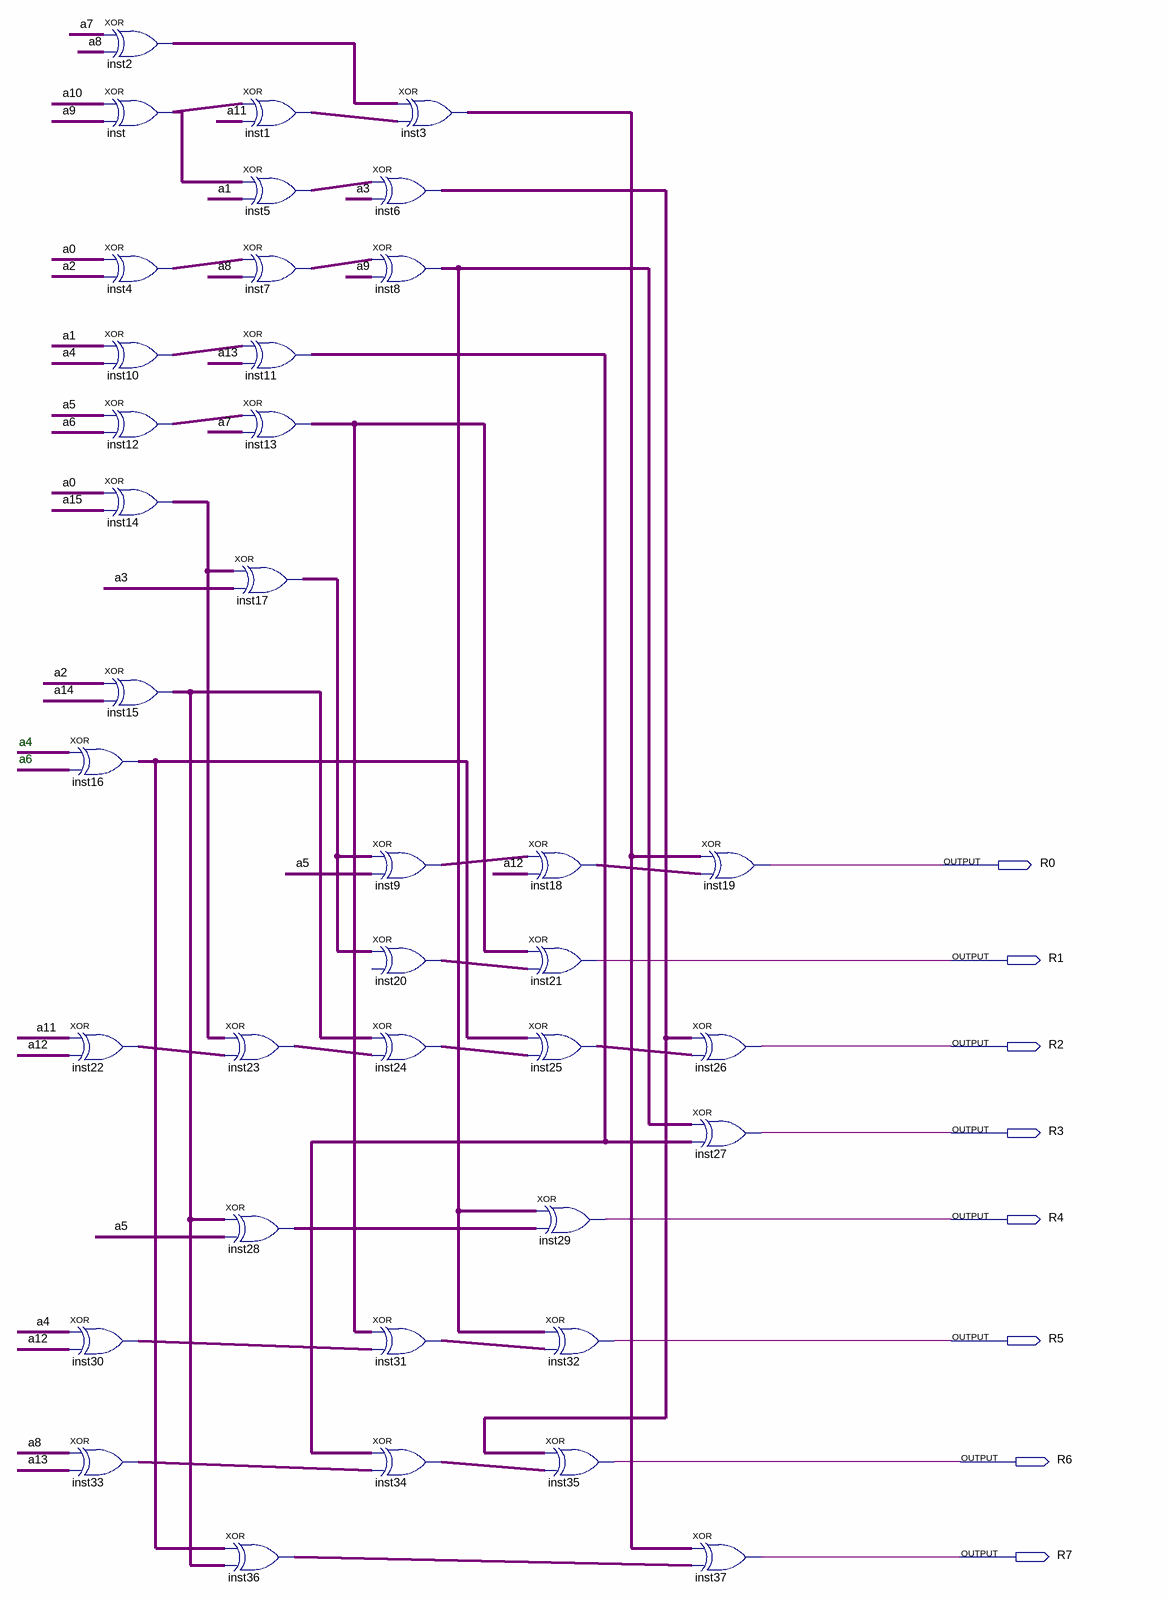
[diagram p0: schematic sheet]
// Quartus schematic encoderV4_Desenho.bdf as structural Verilog: 38 symbols, 8 pins
module encoderV4_Desenho (
  output R0,
  output R1,
  output R2,
  output R3,
  output R4,
  output R5,
  output R6,
  output R7
);

  wire a0, a1, a2, a3, a4, a5, a6, a7, a8, a9, a10, a11, a12, a13, a14, a15, inst1_out, inst2_out, inst3_out,
       inst4_out, inst5_out, inst6_out, inst7_out, inst8_out, inst9_out, inst10_out, inst11_out, inst12_out,
       inst13_out, inst14_out, inst15_out, inst16_out, inst17_out, inst18_out, inst20_out, inst22_out,
       inst23_out, inst24_out, inst25_out, inst28_out, inst30_out, inst31_out, inst33_out, inst34_out,
       inst36_out, inst_out;

  xor inst16 (inst16_out, a4, a6);
  xor inst22 (inst22_out, a11, a12);
  xor inst30 (inst30_out, a4, a12);
  xor inst33 (inst33_out, a8, a13);
  xor inst2 (inst2_out, a7, a8);
  xor inst (inst_out, a10, a9);
  xor inst4 (inst4_out, a0, a2);
  xor inst10 (inst10_out, a1, a4);
  xor inst12 (inst12_out, a5, a6);
  xor inst14 (inst14_out, a0, a15);
  xor inst15 (inst15_out, a2, a14);
  xor inst1 (inst1_out, inst_out, a11);
  xor inst5 (inst5_out, inst_out, a1);
  xor inst7 (inst7_out, inst4_out, a8);
  xor inst11 (inst11_out, inst10_out, a13);
  xor inst13 (inst13_out, inst12_out, a7);
  xor inst17 (inst17_out, inst14_out, a3);
  xor inst23 (inst23_out, inst14_out, inst22_out);
  xor inst28 (inst28_out, inst15_out, a5);
  xor inst36 (inst36_out, inst16_out, inst15_out);
  xor inst3 (inst3_out, inst2_out, inst1_out);
  xor inst6 (inst6_out, inst5_out, a3);
  xor inst8 (inst8_out, inst7_out, a9);
  xor inst9 (inst9_out, inst17_out, a5);
  buf inst20 (inst20_out, inst17_out);  // XOR open: IN2
  xor inst24 (inst24_out, inst15_out, inst23_out);
  xor inst31 (inst31_out, inst13_out, inst30_out);
  xor inst34 (inst34_out, inst11_out, inst33_out);
  xor inst18 (inst18_out, inst9_out, a12);
  xor inst21 (R1, inst13_out, inst20_out);
  xor inst25 (inst25_out, inst16_out, inst24_out);
  xor inst29 (R4, inst8_out, inst28_out);
  xor inst32 (R5, inst8_out, inst31_out);
  xor inst35 (R6, inst6_out, inst34_out);
  xor inst19 (R0, inst3_out, inst18_out);
  xor inst26 (R2, inst6_out, inst25_out);
  xor inst27 (R3, inst8_out, inst11_out);
  xor inst37 (R7, inst3_out, inst36_out);

  // Notes on the sheet:
  //   a4
  //   a6
endmodule
